# EAGLE design jkGate (EAGLE 9.6.2)
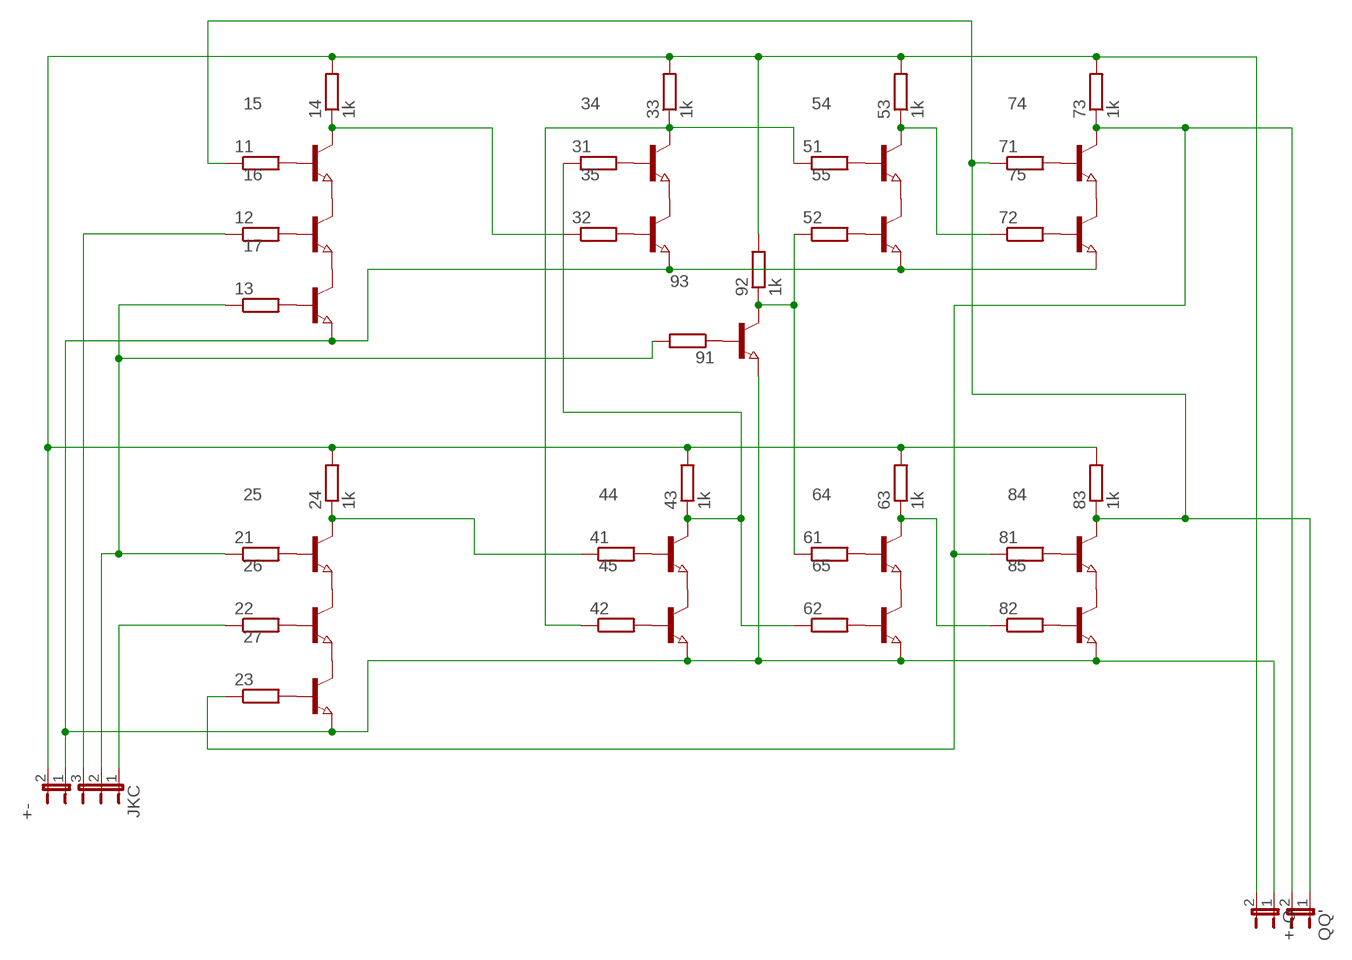
[diagram p0: schematic, sheet 1]

## Parts
11  R-EU_R1206  [R1206]
12  R-EU_R1206  [R1206]
13  R-EU_R1206  [R1206]
14  1k  R-EU_R1206  [R1206]
15  NPN-TRANSISTOR_SOT23  [SOT23]
16  NPN-TRANSISTOR_SOT23  [SOT23]
17  NPN-TRANSISTOR_SOT23  [SOT23]
21  R-EU_R1206  [R1206]
22  R-EU_R1206  [R1206]
23  R-EU_R1206  [R1206]
24  1k  R-EU_R1206  [R1206]
25  NPN-TRANSISTOR_SOT23  [SOT23]
26  NPN-TRANSISTOR_SOT23  [SOT23]
27  NPN-TRANSISTOR_SOT23  [SOT23]
31  R-EU_R1206  [R1206]
32  R-EU_R1206  [R1206]
33  1k  R-EU_R1206  [R1206]
34  NPN-TRANSISTOR_SOT23  [SOT23]
35  NPN-TRANSISTOR_SOT23  [SOT23]
41  R-EU_R1206  [R1206]
42  R-EU_R1206  [R1206]
43  1k  R-EU_R1206  [R1206]
44  NPN-TRANSISTOR_SOT23  [SOT23]
45  NPN-TRANSISTOR_SOT23  [SOT23]
51  R-EU_R1206  [R1206]
52  R-EU_R1206  [R1206]
53  1k  R-EU_R1206  [R1206]
54  NPN-TRANSISTOR_SOT23  [SOT23]
55  NPN-TRANSISTOR_SOT23  [SOT23]
61  R-EU_R1206  [R1206]
62  R-EU_R1206  [R1206]
63  1k  R-EU_R1206  [R1206]
64  NPN-TRANSISTOR_SOT23  [SOT23]
65  NPN-TRANSISTOR_SOT23  [SOT23]
71  R-EU_R1206  [R1206]
72  R-EU_R1206  [R1206]
73  1k  R-EU_R1206  [R1206]
74  NPN-TRANSISTOR_SOT23  [SOT23]
75  NPN-TRANSISTOR_SOT23  [SOT23]
81  R-EU_R1206  [R1206]
82  R-EU_R1206  [R1206]
83  1k  R-EU_R1206  [R1206]
84  NPN-TRANSISTOR_SOT23  [SOT23]
85  NPN-TRANSISTOR_SOT23  [SOT23]
91  R-EU_R1206  [R1206]
92  1k  R-EU_R1206  [R1206]
93  NPN-TRANSISTOR_SOT23  [SOT23]
+-  JP1E  [JP1]
+-O  JP1E  [JP1]
JKC  JP2E  [JP2]
QQ'  JP1E  [JP1]

## Nets
5V: 14.2 24.2 33.2 43.2 53.2 63.2 73.2 83.2 92.2 +-.2 +-O.2
C: 13.1 21.1 91.2 JKC.2
GND: 17.2(E) 27.2(E) 35.2(E) 45.2(E) 55.2(E) 65.2(E) 75.2(E) 85.2(E) 93.2(E) +-.1 +-O.1
J: 12.1 JKC.3
K: 22.1 JKC.1
N$1: 15.2(E) 16.3(C)
N$2: 16.2(E) 17.3(C)
N$3: 25.2(E) 26.3(C)
N$4: 26.2(E) 27.3(C)
N$5: 34.2(E) 35.3(C)
N$6: 44.2(E) 45.3(C)
N$7: 54.2(E) 55.3(C)
N$8: 64.2(E) 65.3(C)
N$9: 74.2(E) 75.3(C)
N$10: 84.2(E) 85.3(C)
N$11: 21.2 25.1(B)
N$12: 22.2 26.1(B)
N$13: 23.2 27.1(B)
N$14: 11.2 15.1(B)
N$15: 12.2 16.1(B)
N$16: 13.2 17.1(B)
N$17: 31.2 34.1(B)
N$18: 32.2 35.1(B)
N$19: 51.2 54.1(B)
N$20: 52.2 55.1(B)
N$21: 71.2 74.1(B)
N$22: 72.2 75.1(B)
N$23: 81.2 84.1(B)
N$24: 82.2 85.1(B)
N$25: 61.2 64.1(B)
N$26: 62.2 65.1(B)
N$27: 41.2 44.1(B)
N$28: 42.2 45.1(B)
N$29: 24.1 25.3(C) 41.1
N$30: 31.1 43.1 44.3(C) 62.1
N$31: 63.1 64.3(C) 82.1
N$32: 11.1 71.1 83.1 84.3(C) QQ'.1
N$33: 14.1 15.3(C) 32.1
N$34: 33.1 34.3(C) 42.1 51.1
N$35: 53.1 54.3(C) 72.1
N$36: 23.1 73.1 74.3(C) 81.1 QQ'.2
N$39: 52.1 61.1 92.1 93.3(C)
N$40: 91.1 93.1(B)

## Library data of the parts
11-14 21-24 31-33 41-43 51-53 61-63 71-73 81-83 91 92 = rcl:R-EU_: RESISTOR, European symbol; SPICEPREFIX: R
15-17 25-27 34 35 44 45 54 55 64 65 74 75 84 85 93 = semicon-smd-ipc:NPN-TRANSISTOR_: NPN TRANSISTOR
+- +-O QQ' = jumper:JP1E: JUMPER
JKC = jumper:JP2E: JUMPER

## Board
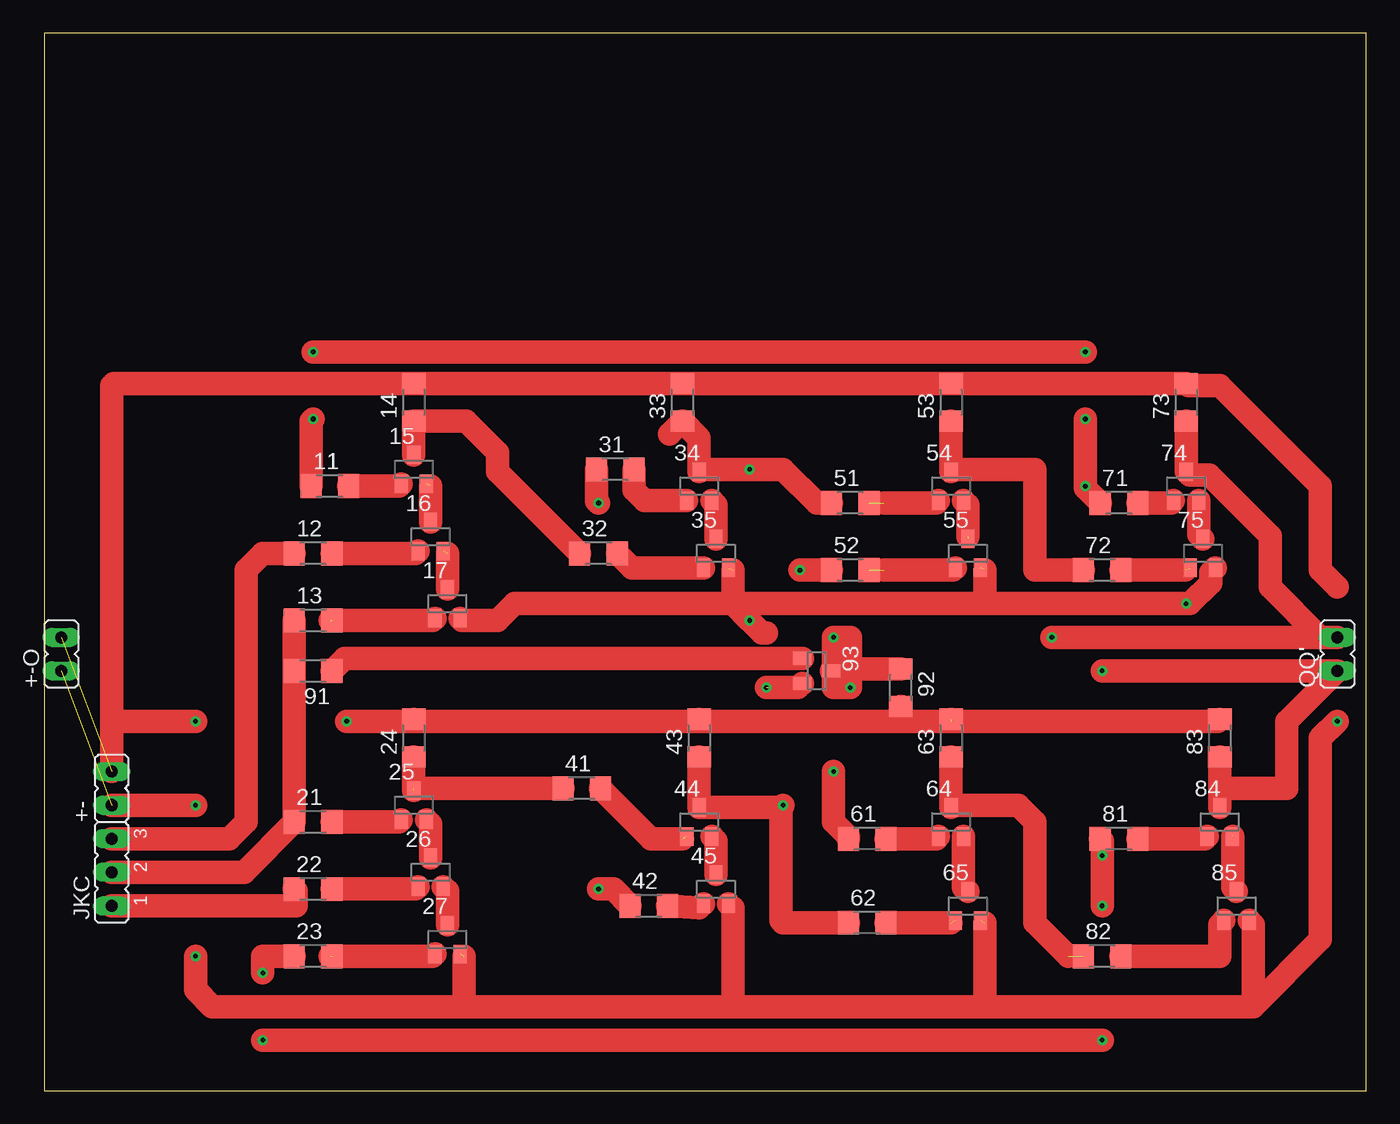
[diagram p1: board, top side]
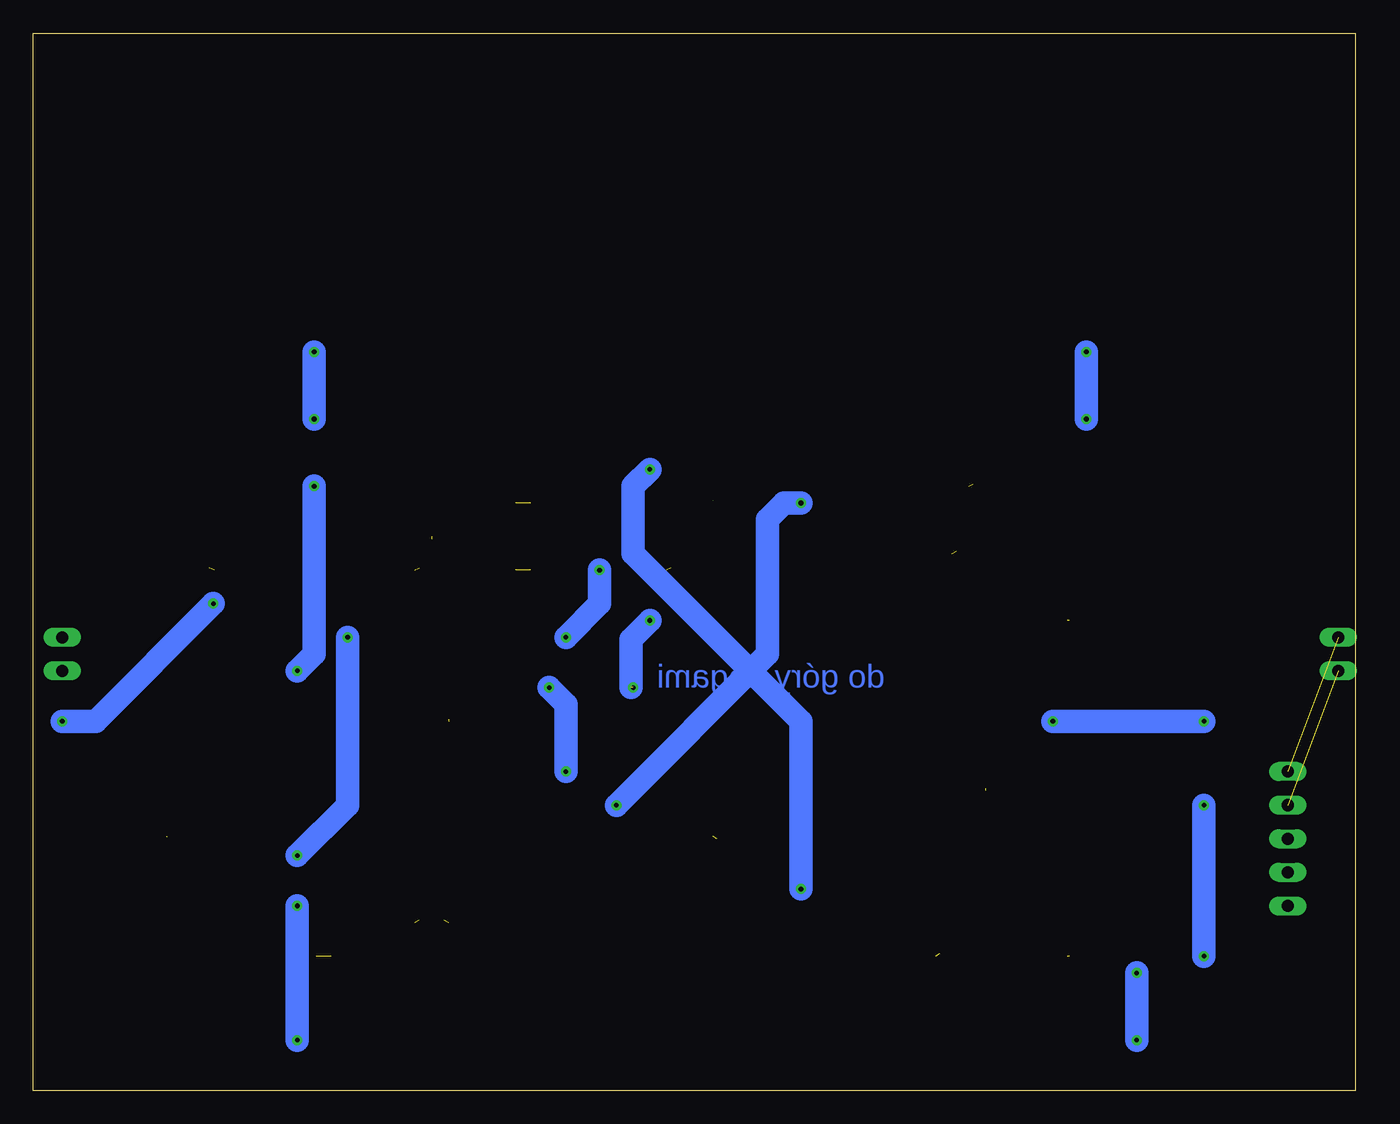
[diagram p2: board, bottom side, seen from below]

Size 100 x 80 mm. Coordinates in mm from the lower left corner, seen from the top.
Outline: 0,0 100,0 100,80 0,80 0,0
Copper layers (1*16): Top 0.035mm / dielectric 1.5mm / Bottom 0.035mm
Design rules "default": minimum track width 6mil, minimum drill 0.35mm, track to track 6mil, track to pad 6mil, pad to pad 6mil, via to via 6mil, smd to smd 6mil, copper to edge 40mil, drill to drill 6mil, minimum pad ring 10mil, minimum via ring 8mil, stop-mask expansion 4mil, vias tented up to drill 0mil, thermal gap 10mil

### Footprints (pad centres in the part's own frame; a part is rotated, then mirrored left to right if it is on the bottom)
R1206 = smd 1.6 x 1.803: 1 -1.422,0; 2 1.422,0
SOT23 = smd 1 x 1.4: 1 -0.95,-1.1; 2 0.95,-1.1; 3 0,1.1
JP1 = drill 0.914 long: 1 0,-1.27; 2 0,1.27
JP2 = drill 0.914 long: 1 -2.54,0; 2 0,0; 3 2.54,0

### Placement (x,y rotation side)
11  21.59,45.72 0 top
12  20.32,40.64 0 top
13  20.32,35.56 0 top
14  27.94,52.07 90 top
15  27.94,46.99 0 top
16  29.21,41.91 0 top
17  30.48,36.83 0 top
21  20.32,20.32 0 top
22  20.32,15.24 0 top
23  20.32,10.16 0 top
24  27.94,26.67 90 top
25  27.94,21.59 0 top
26  29.21,16.51 0 top
27  30.48,11.43 0 top
31  43.18,46.99 0 top
32  41.91,40.64 0 top
33  48.26,52.07 90 top
34  49.53,45.72 0 top
35  50.8,40.64 0 top
41  40.64,22.86 0 top
42  45.72,13.97 0 top
43  49.53,26.67 90 top
44  49.53,20.32 0 top
45  50.8,15.24 0 top
51  60.96,44.45 0 top
52  60.96,39.37 0 top
53  68.58,52.07 90 top
54  68.58,45.72 0 top
55  69.85,40.64 0 top
61  62.23,19.05 0 top
62  62.23,12.7 0 top
63  68.58,26.67 90 top
64  68.58,20.32 0 top
65  69.85,13.97 0 top
71  81.28,44.45 0 top
72  80.01,39.37 0 top
73  86.36,52.07 90 top
74  86.36,45.72 0 top
75  87.63,40.64 0 top
81  81.28,19.05 0 top
82  80.01,10.16 0 top
83  88.9,26.67 90 top
84  88.9,20.32 0 top
85  90.17,13.97 0 top
91  20.32,31.75 180 top
92  64.77,30.48 270 top
93  58.42,31.75 270 top
+-  5.08,22.86 0 top
+-O  1.27,33.02 0 top
JKC  5.08,16.51 90 top
QQ'  97.79,33.02 0 top

### Tracks (layer width: path | path; a pad name or v marks a point on that pad's centre or on a via)
5V  (via drill 0.35)  (2 unrouted)
  Top 1.778: 5.08,27.94 5.08,53.34 5.23,53.49 14.2 33.2 53.2 73.2 86.51,53.34 88.9,53.34 96.52,45.72 96.52,39.37 97.79,38.1 | 5.08,27.94 +-.2 | 49.53,27.94 28.09,27.94 24.2 27.79,27.94 v22.86,27.94 | 49.53,27.94 43.2 | 63.2 68.43,27.94 64.77,27.94 | 64.77,27.94 49.53,27.94 | 68.58,27.94 88.75,27.94 83.2 | 92.2 64.77,27.94 | 5.08,27.94 v11.43,27.94
  Bottom 1.778: v11.43,27.94 v22.86,27.94
C
  Top 1.778: 13.1 91.2 21.1 15.09,16.51 JKC.2
GND  (via drill 0.35)  (6 unrouted)
  Top 1.778: 31.75,6.35 12.7,6.35 11.43,7.62 v11.43,10.16 | 31.75,6.35 31.75,10.16 | 31.75,6.35 52.07,6.35 | 45.2 52.07,13.82 52.07,6.35 | 52.07,6.35 71.12,6.35 | 71.12,6.35 91.44,6.35 | 91.44,6.35 91.44,12.55 85.2 | 71.12,6.35 71.12,12.7 | 75.2 88.22,39.18 88.22,38.41 86.64,36.83 v86.36,36.83 71.12,36.83 | 71.12,36.83 71.12,39.37 | 71.12,36.83 52.07,36.83 | 52.07,39.37 52.07,36.83 | 52.07,36.83 35.56,36.83 34.29,35.56 31.6,35.56 17.2 | +-.1 v11.43,21.59 | 91.44,6.35 96.52,11.43 96.52,26.67 v97.79,27.94 | 93.2 57,30.48 v54.61,30.48 | 52.07,36.83 v53.34,35.56 54.27,34.63 54.61,34.63
  Bottom 1.778: v11.43,21.59 v11.43,10.16 | v53.34,35.56 54.76,34.14 54.76,30.48 | v97.79,27.94 95.25,27.94 v86.36,36.83
J
  Top 1.778: JKC.3 13.97,19.05 15.24,20.32 15.24,39.37 16.51,40.64 12.1
K
  Top 1.778: JKC.1 19.05,13.97 19.05,15.09 22.1
N$1  (1 unrouted)
  Top 1.778: 16.3 29.21,45.72
N$2  (1 unrouted)
  Top 1.778: 17.3 30.48,40.64
N$3
  Top 1.778: 25.2 29.21,20.17 26.3
N$4
  Top 1.778: 26.2 30.48,15.09 27.3
N$5
  Top 1.778: 34.2 50.8,44.3 35.3
N$6
  Top 1.778: 44.2 50.8,18.9 45.3
N$7  (1 unrouted)
  Top 1.778: 54.2 69.85,44.3 69.85,41.91
N$8
  Top 1.778: 65.3 69.53,15.39 64.2
N$9
  Top 1.778: 75.3 87.31,42.06 74.2
N$10  (1 unrouted)
  Top 1.778: 85.3 89.88,15.36 89.88,19.22
N$11
  Top 1.778: 25.1 26.82,20.32 21.2
N$12
  Top 1.778: 26.1 28.09,15.24 22.2
N$13  (1 unrouted)
  Top 1.778: 27.1 29.36,10.16 21.59,10.16
N$14
  Top 1.778: 15.1 26.82,45.72 11.2
N$15
  Top 1.778: 16.1 28.09,40.64 12.2
N$16  (1 unrouted)
  Top 1.778: 17.1 29.36,35.56 21.59,35.56
N$17  (1 unrouted)
  Top 1.778: 48.55,44.62 45.4,44.62 44.6,45.42 31.2
N$18
  Top 1.778: 35.1 44.43,39.54 32.2
N$19  (1 unrouted)
  Top 1.778: 54.1 67.46,44.45 63.5,44.45
N$20  (1 unrouted)
  Top 1.778: 55.1 68.73,39.37 63.5,39.37
N$21
  Top 1.778: 74.1 85.24,44.45 71.2
N$22  (1 unrouted)
  Top 1.778: 72.2 86.29,39.37
N$23
  Top 1.778: 84.1 87.78,19.05 81.2
N$24
  Top 1.778: 82.2 88.9,10.16 88.9,12.55 85.1
N$25
  Top 1.778: 64.1 67.46,19.05 61.2
N$26  (1 unrouted)
  Top 1.778: 62.2 68.58,12.7
N$27  (1 unrouted)
  Top 1.778: 41.2 45.87,19.05 48.26,19.05
N$28
  Top 1.778: 45.1 49.53,13.82 42.2
N$29  (1 unrouted)
  Top 1.778: 24.1 27.94,22.86 | 25.3 28.11,22.86 41.1
N$30  (via drill 0.35)
  Top 1.778: 43.1 44.3 55.71,21.42 | 55.71,21.42 v55.88,21.59 | 62.1 55.88,12.7 55.71,12.87 55.71,21.42 | 31.1 41.76,44.6 v41.91,44.45
  Bottom 1.778: v55.88,21.59 44.45,33.02 44.45,43.18 43.18,44.45 v41.91,44.45
N$31  (1 unrouted)
  Top 1.778: 63.1 64.3 68.75,21.59 73.66,21.59 74.93,20.32 74.93,12.7 77.47,10.16
N$32  (via drill 0.35)
  Top 1.778: 83.1 88.9,22.86 | 88.9,22.86 84.3 | 88.9,22.86 93.98,22.86 93.98,27.94 QQ'.1 v80.01,31.75 | 71.1 78.74,45.57 v78.74,45.72 v78.74,50.8 | 11.1 20.17,50.65 v20.32,50.8 | v20.32,55.88 v78.74,55.88
  Bottom 1.778: v20.32,50.8 v20.32,55.88 | v78.74,50.8 v78.74,55.88 | v80.01,31.75 78.74,33.02 v78.74,45.72
N$33
  Top 1.778: 32.1 34.29,46.84 34.29,48.26 31.9,50.65 14.1 15.3
N$34  (via drill 0.35)
  Top 1.778: 49.53,46.99 49.53,49.38 33.1 47.29,49.68 | 49.53,46.99 34.3 | 51.1 58.42,44.45 55.88,46.99 v53.34,46.99 49.53,46.99 | 42.1 43.03,15.24 v41.91,15.24
  Bottom 1.778: v41.91,15.24 41.91,27.94 54.61,40.64 54.61,45.72 v53.34,46.99
N$35
  Top 1.778: 53.1 54.3 68.75,46.99 74.93,46.99 74.93,39.37 72.1
N$36  (via drill 0.35)
  Top 1.778: 73.1 74.3 86.63,46.55 88.11,46.55 92.71,41.95 92.71,38.1 96.52,34.29 QQ'.2 v76.2,34.29 | 81.1 80.01,18.9 v80.01,17.78 v80.01,13.97 | v80.01,3.81 v16.51,3.81 | 23.1 16.51,10.16 v16.51,8.89
  Bottom 1.778: v80.01,13.97 v80.01,3.81 | v16.51,8.89 v16.51,3.81 | v80.01,17.78 76.2,21.59 v76.2,34.29
N$39  (via drill 0.35)
  Top 1.778: 59.67,31.9 92.1 | 93.3 59.67,31.9 | 59.67,31.9 59.69,31.92 v59.69,34.29 60.96,34.29 v60.96,30.48 59.69,30.48 59.67,30.5 59.67,31.9 | 61.1 60.81,19.2 59.69,20.32 v59.69,24.13 | 52.1 v57.15,39.37
  Bottom 1.778: v57.15,39.37 57.15,36.83 v59.69,34.29 | v59.69,24.13 59.69,29.21 v60.96,30.48
N$40
  Top 1.778: 91.1 22.69,32.7 93.1

### Text on the board
Bottom: do góry nogami